# EAGLE schematic cable 3 (EAGLE 9.3.0)
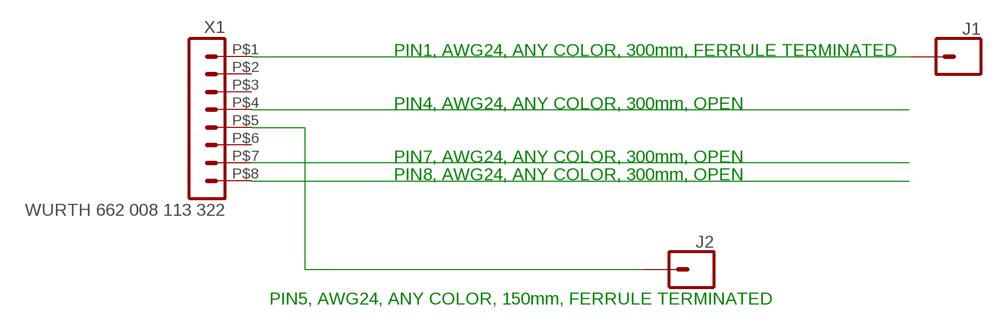
[diagram p0: schematic, sheet 1]

## Parts
J1  CONN_01  [1X01]
J2  CONN_01  [1X01]
X1  WURTH 662 008 113 322  HEADER_POS8_43045-0800  [43045-0800]

## Nets
N$1: J1.1 X1.P$1
N$2: J2.1 X1.P$5
N$3: X1.P$4
N$5: X1.P$7
N$6: X1.P$8
Unconnected: X1.P$2 X1.P$3 X1.P$6

## Notes on the sheet
- PIN1, AWG24, ANY COLOR, 300mm, FERRULE TERMINATED
- PIN4, AWG24, ANY COLOR, 300mm, OPEN
- PIN7, AWG24, ANY COLOR, 300mm, OPEN
- PIN8, AWG24, ANY COLOR, 300mm, OPEN
- PIN5, AWG24, ANY COLOR, 150mm, FERRULE TERMINATED

## Library data of the parts
J1 J2 = SparkFun-Connectors:CONN_01: Single connection point. Often used as Generic Header-pin footprint for 0.1 inch spaced/style header connections On any of the 0.1 inch spaced packages, you can populate with these: Break Away Headers - Straight <https://www.sparkfun.com/products/116> (PRT-00116) Break Away Male Headers - Right Angle <https://www.sparkfun.com/products/553> (PRT-00553) Female Headers <https://www.sparkfun.com/products/115> (PRT-00115) Break Away Headers - Machine Pin <https://www.sparkfun.com/products/117> (PRT-00117) Break Away Female Headers - Swiss Machine Pin <https://www.sparkfun.com/products/743> (PRT-00743) This device is also useful as a general connection point to wire up your design to another part of your project. Our various solder wires solder well into these plated through hole pads. Hook-Up Wire - Assortment (Stranded, 22 AWG) <https://www.sparkfun.com/products/11375> (PRT-11375) Hook-Up Wire - Assortment (Solid Core, 22 AWG) <https://www.sparkfun.com/products/11367> (PRT-11367) View the entire wire category on our website here <https://www.sparkfun.com/categories/141> Special notes: SMTSO-256-ET is a "flush mount" nut for a 4-40 screw. We mostly use this on specialty testbeds; it is a nice way to connect hardware to your PCB at an adjustable hieght. Also note, the SNAP packages are for using a snappable style connector. We sell a baggie of snaps and they are also used on two LilyPad designs: Snap Assortment - 30 pack (male and female) <https://www.sparkfun.com/products/11347> (DEV-11347) LilyPad Arduino SimpleSnap <https://www.sparkfun.com/products/10941> (DEV-10941) LilyPad SimpleSnap Protoboard <https://www.sparkfun.com/products/10940> (DEV-10940)
X1 = con-molex-micro-fit-3_0:HEADER_POS8_?: Molex - Micro-Fit 3.0 Series connector, 3.00mm (0.118") pitch header, 8 positions.